# Altium schematic sheet Signal Latch Logic.SchDoc: Signal Latch Logic
size A4; SheetNumber: 37; SheetTotal: 37
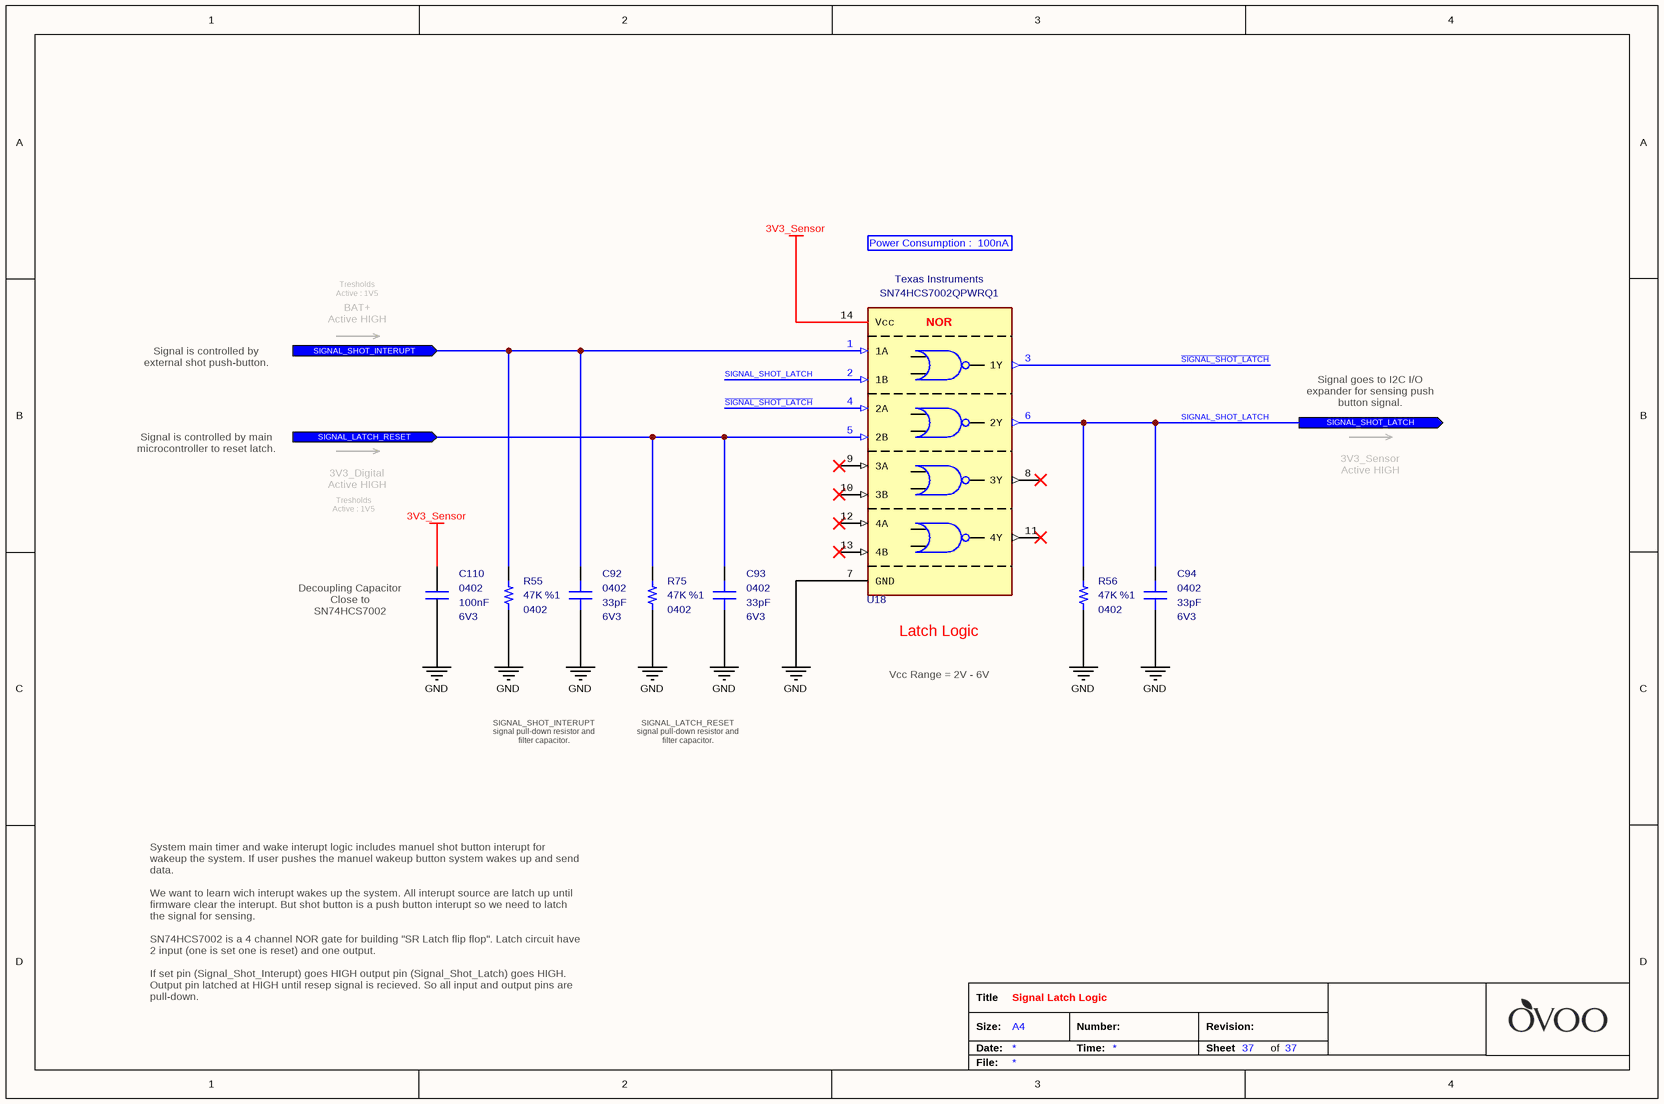
[diagram p0: Signal Latch Logic.SchDoc]

## Parts
C92  value 33pF  Case: 0402  Voltage: 6V3  [CAPACITOR_0402]  (hidden comment: Multilayer Ceramic Capacitor)
C93  value 33pF  Case: 0402  Voltage: 6V3  [CAPACITOR_0402]  (hidden comment: Multilayer Ceramic Capacitor)
C94  value 33pF  Case: 0402  Voltage: 6V3  [CAPACITOR_0402]  (hidden comment: Multilayer Ceramic Capacitor)
C110  value 100nF  Case: 0402  Voltage: 6V3  [CAPACITOR_0402]  (hidden comment: Multilayer Ceramic Capacitor)
R55  value 47K  Tolerance: %1  Case: 0402  [RESISTOR_0402]  (hidden comment: Thick Film Resistor)
R56  value 47K  Tolerance: %1  Case: 0402  [RESISTOR_0402]  (hidden comment: Thick Film Resistor)
R75  value 47K  Tolerance: %1  Case: 0402  [RESISTOR_0402]  (hidden comment: Thick Film Resistor)
U18  Manufacturer_Part_Number: SN74HCS7002QPWRQ1  Manufacturer_Name: Texas Instruments  [TSSOP-14]  (hidden comment: Logic Gate (NOR))

## Ports
SIGNAL_LATCH_RESET (in), SIGNAL_SHOT_INTERUPT (in), SIGNAL_SHOT_LATCH (out)

## Nets
3V3_Sensor: C110.2 U18.14(Vcc)
GND: C92.1 C93.1 C94.1 C110.1 R55.1 R56.1 R75.1 U18.7(GND)
~{SIGNAL_SHOT_LATCH}: U18.3(1Y) U18.4(2A)
SIGNAL_LATCH_RESET: C93.2 R75.2 U18.5(2B) ; port SIGNAL_LATCH_RESET
SIGNAL_SHOT_INTERUPT: C92.2 R55.2 U18.1(1A) ; port SIGNAL_SHOT_INTERUPT
SIGNAL_SHOT_LATCH: C94.2 R56.2 U18.2(1B) U18.6(2Y) ; port SIGNAL_SHOT_LATCH

Not connected (* = marked no-connect by the designer): U18 8(3Y)* 9(3A)* 10(3B)* 11(4Y)* 12(4A)* 13(4B)*

## Notes on the sheet
- Power Consumption :  100nA
- BAT+
  Active HIGH
- Tresholds
  Active : 1V5
- Signal is controlled by external shot push-button.
- Signal goes to I2C I/O expander for sensing push button signal.
- Signal is controlled by main microcontroller to reset latch.
- 3V3_Sensor
  Active HIGH
- 3V3_Digital
  Active HIGH
- (near C110) Decoupling Capacitor
  Close to SN74HCS7002
  Pin-14 (Vcc)
- Vcc Range = 2V - 6V
- (near U18) Latch Logic
- SIGNAL_SHOT_INTERUPT signal pull-down resistor and filter capacitor.
- SIGNAL_LATCH_RESET signal pull-down resistor and filter capacitor.
- System main timer and wake interupt logic includes manuel shot button interupt for wakeup the system. If user pushes the manuel wakeup button system wakes up and send data.
  We want to learn wich interupt wakes up the system. All interupt source are latch up until firmware clear the interupt. But shot button is a push button interupt so we need to latch the signal for sensing.
  SN74HCS7002 is a 4 channel NOR gate for building "SR Latch flip flop". Latch circuit have 2 input (one is set one is reset) and one output.
  If set pin (Signal_Shot_Interupt) goes HIGH output pin (Signal_Shot_Latch) goes HIGH. Output pin latched at HIGH until resep signal is recieved. So all input and output pins are pull-down.
- Title
- Size:
- Date:
- A4
- Number:
- Time:
- Revision:
- Sheet
- of
- File:
- (in symbol IC - SN74HCS7002QPWRQ1) NOR

## Library data of the parts
C92-C94 = Capacitor - 33pF [0402-6V3]: Capacitor - 33pF [0402] (Ceramic); Manufacturer_Name: Kemet; Manufacturer_Part_Number: C0402C330J9RACAUTO; Dielectric: X7R; Tolerance: 10%; Height: 0.5mm; Mouser_Part_Number: 80-C0402C330J9RAUTO; Maximum Operating Temperature: +125; Minimum Operating Temperature: -55; ROHS: Yes; ComponentLink1Description: DataSheet; ComponentLink1URL: https://api.kemet.com/component-edge/download/datasheet/C0402C330J9RACAUTO.pdf; ComponentLink2Description: Mouser; ComponentLink2URL: https://www.mouser.com/Search/Refine.aspx?Keyword=80-C0402C330J9RAUTO; Supplier 1: Mouser; Supplier Part Number 1: 80-C0402C330J9RAUTO
C110 = Capacitor - 100nF [0402-6V3]: Capacitor - 100nF [0402-6V3] (Ceramic); Manufacturer_Name: AVX; Manufacturer_Part_Number: 04026D104KAT4A; Dielectric: X5R; Tolerance: %10; Height: 0.25mm; Mouser_Part_Number: 581-04026D104KAT4A; ComponentLink1Description: Mouser; ComponentLink1URL: https://www.mouser.com.tr/ProductDetail/AVX/04026D104KAT4A?qs=sGAEpiMZZMs0AnBnWHyRQPg4iYkCw7IMED%2F4kpqgf7w%3D; ComponentLink2Description: DataSheet; ComponentLink2URL: https://www.mouser.com.tr/datasheet/2/40/cx5r-776519.pdf; ROHS: Yes; Maximum Operating Temperature: +85; Minimum Operating Temperature: -55; Supplier 1: Avnet; Supplier Part Number 1: 04026D104KAT4A
R55 R56 R75 = Resistor - 47K: Thick Film Resistors - SMD 1/16 W 47 Kohms 1%; Manufacturer_Name: Vishay; Manufacturer_Part_Number: CRCW040247K0FKED; Height: 0.4mm; Mouser_Part_Number: 71-CRCW0402-47K-E3; ComponentLink1Description: DataSheet; ComponentLink1URL: https://www.mouser.com.tr/datasheet/2/427/dcrcwe3-1762152.pdf; ComponentLink2Description: Mouser; ComponentLink2URL: https://www.mouser.com.tr/ProductDetail/Vishay-Dale/CRCW040247K0FKED?qs=sGAEpiMZZMu61qfTUdNhG2DpbjADlD3GL%252B3h1elTxqU%3D; Supplier 1: Mouser; Supplier 2: Digi-Key; Supplier Part Number 1: 71-CRCW040247K0FKEDH; Supplier Part Number 2: 541-47.0KYCT-ND
U18 = IC - SN74HCS7002QPWRQ1: Logic Gates Quadruple 2-input NOR gates with Schmitt-trigger inputs 14-TSSOP -40 to 125; Mouser_Part_Number: 595-N74HCS7002QPWRQ1; ComponentLink1Description: DataSheet; ComponentLink1URL: http://www.ti.com/lit/ds/symlink/sn74hcs7002-q1.pdf; ComponentLink2Description: Mouser; ComponentLink2URL: https://www.mouser.com.tr/ProductDetail/Texas-Instruments/SN74HCS7002QPWRQ1?qs=B6kkDfuK7%2FD8gt2COF3EEA%3D%3D; Minimum Operating Temperature: -40; Maximum Operating Temperature: +125; Case: TSSOP-14; Supplier 1: Mouser; Supplier 2: Digi-Key; Supplier Part Number 1: 595-N74HCS7002QPWRQ1; Supplier Part Number 2: 296-SN74HCS7002QPWRQ1CT-ND